# EasyEDA Pro project 第十届农装PCB工程.epro, board 作业板_2024_9
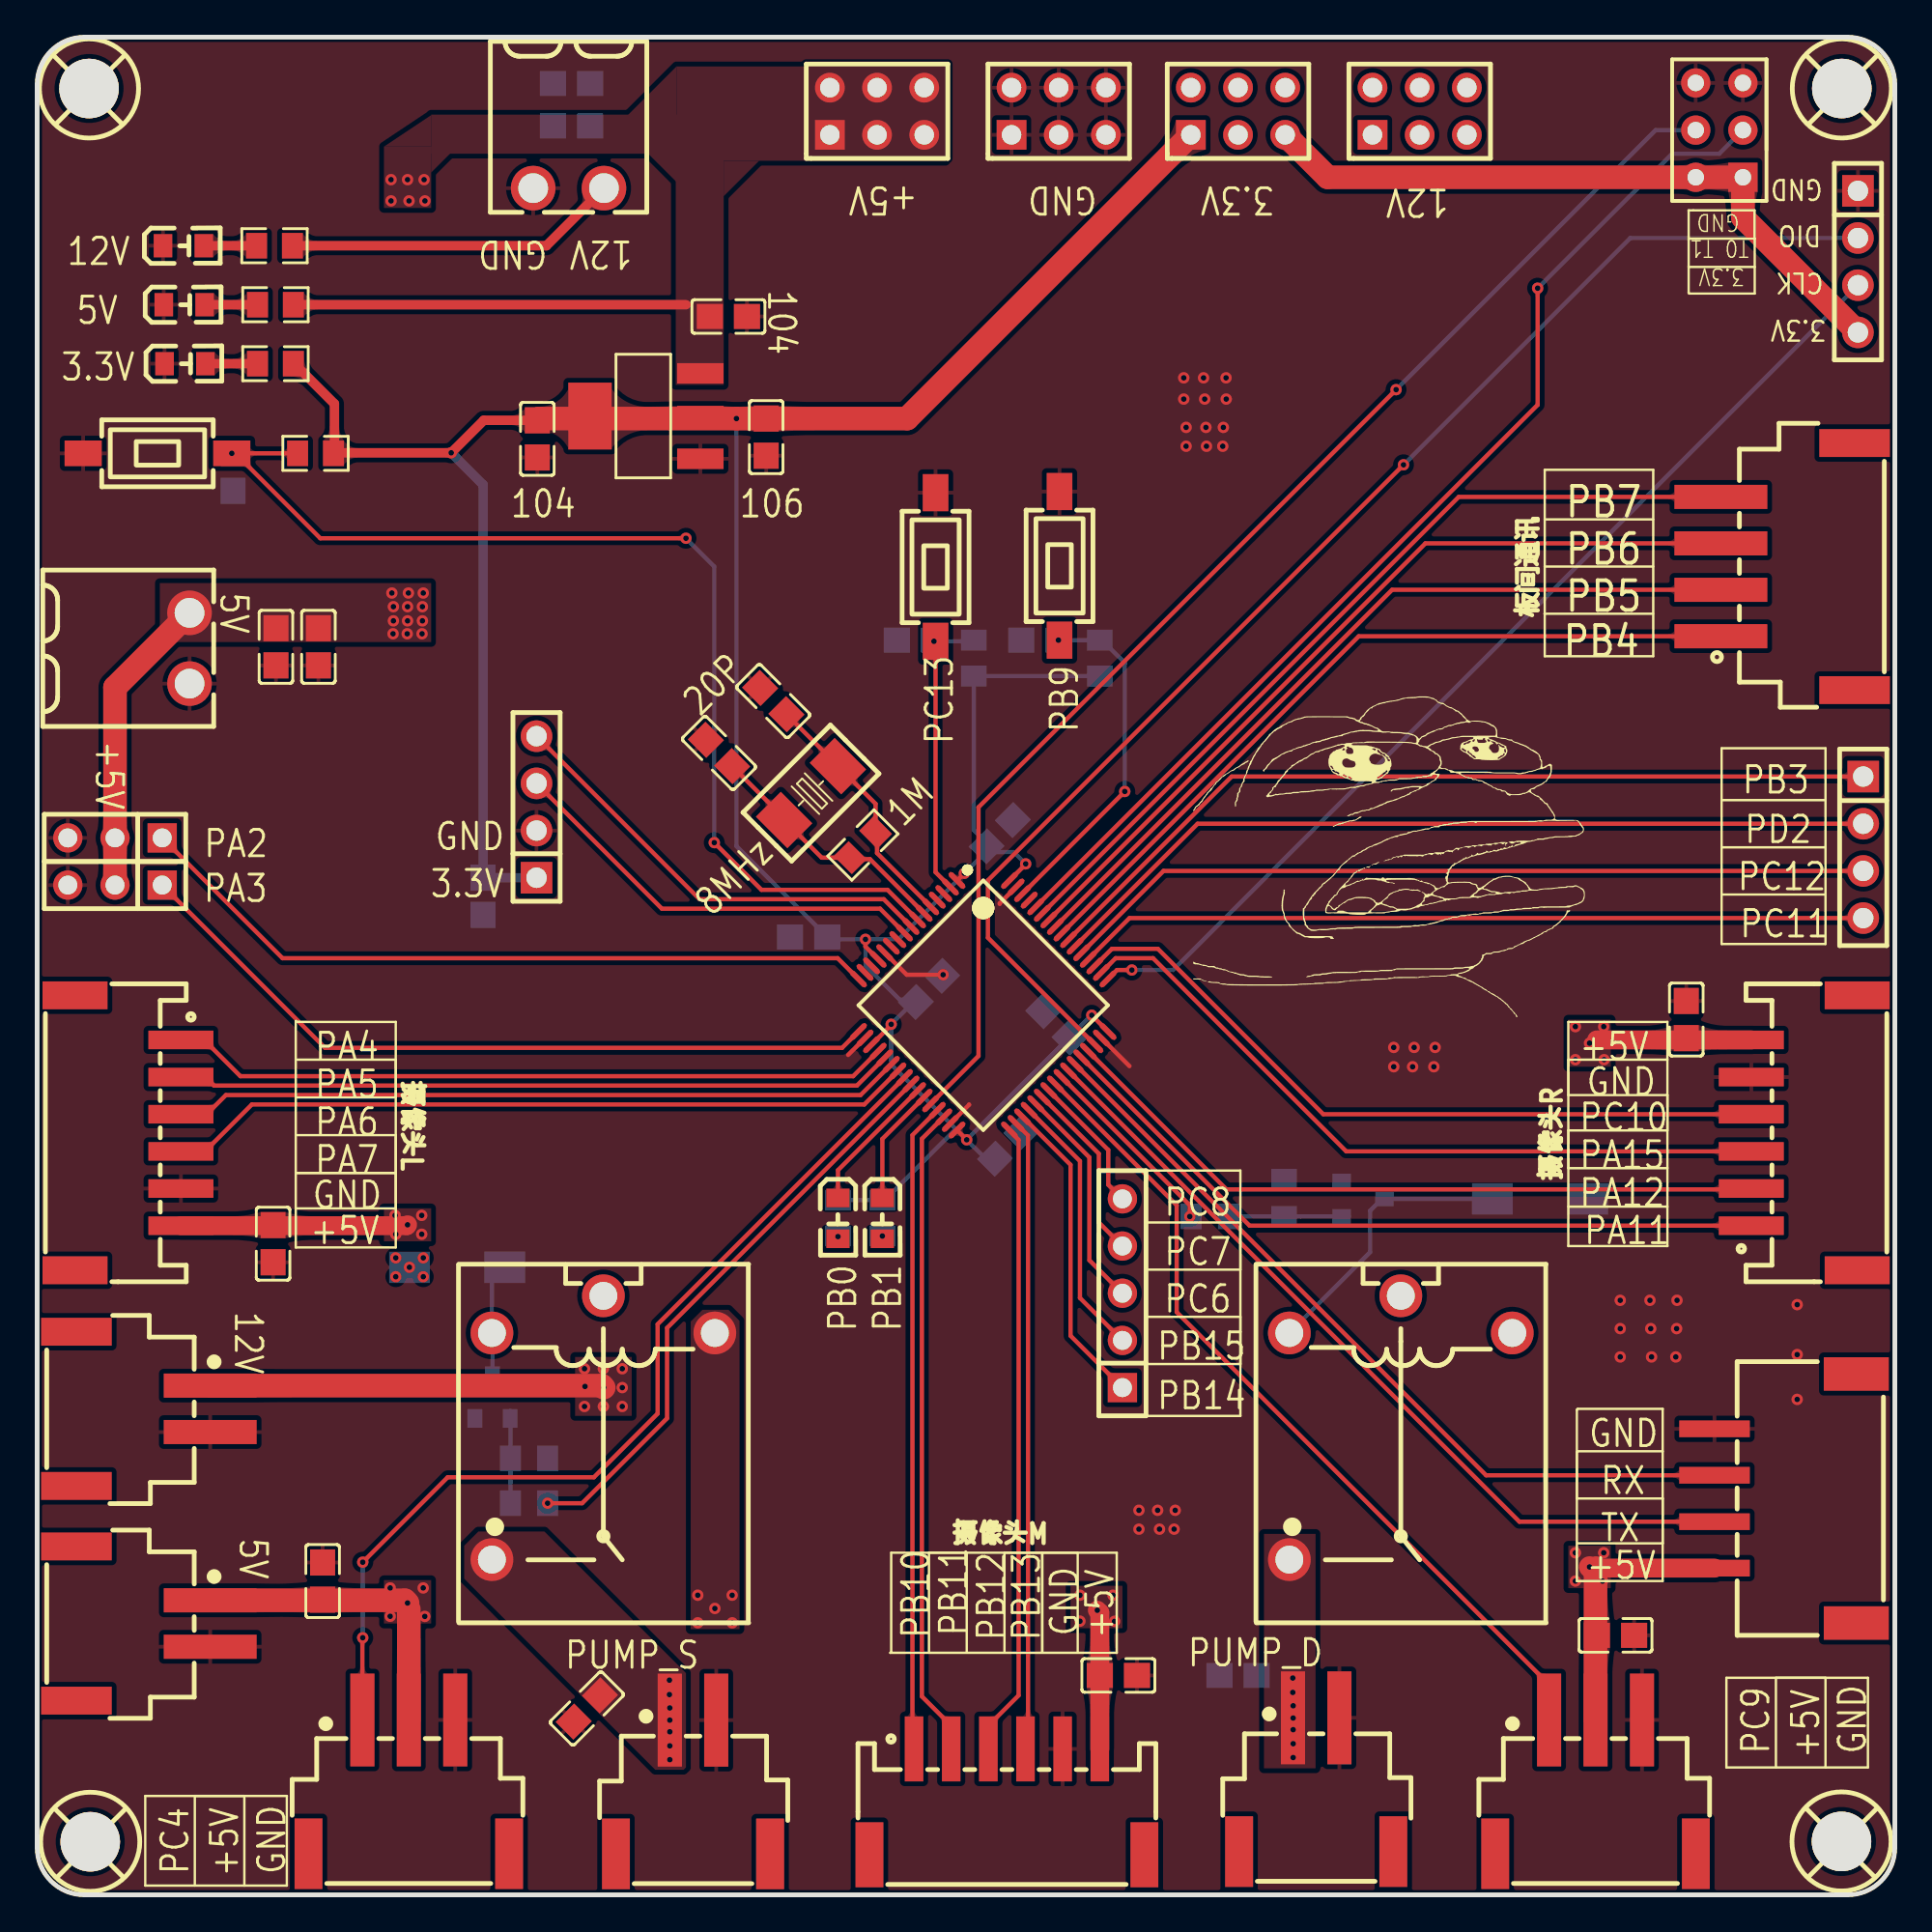
[diagram p5: board, top side]
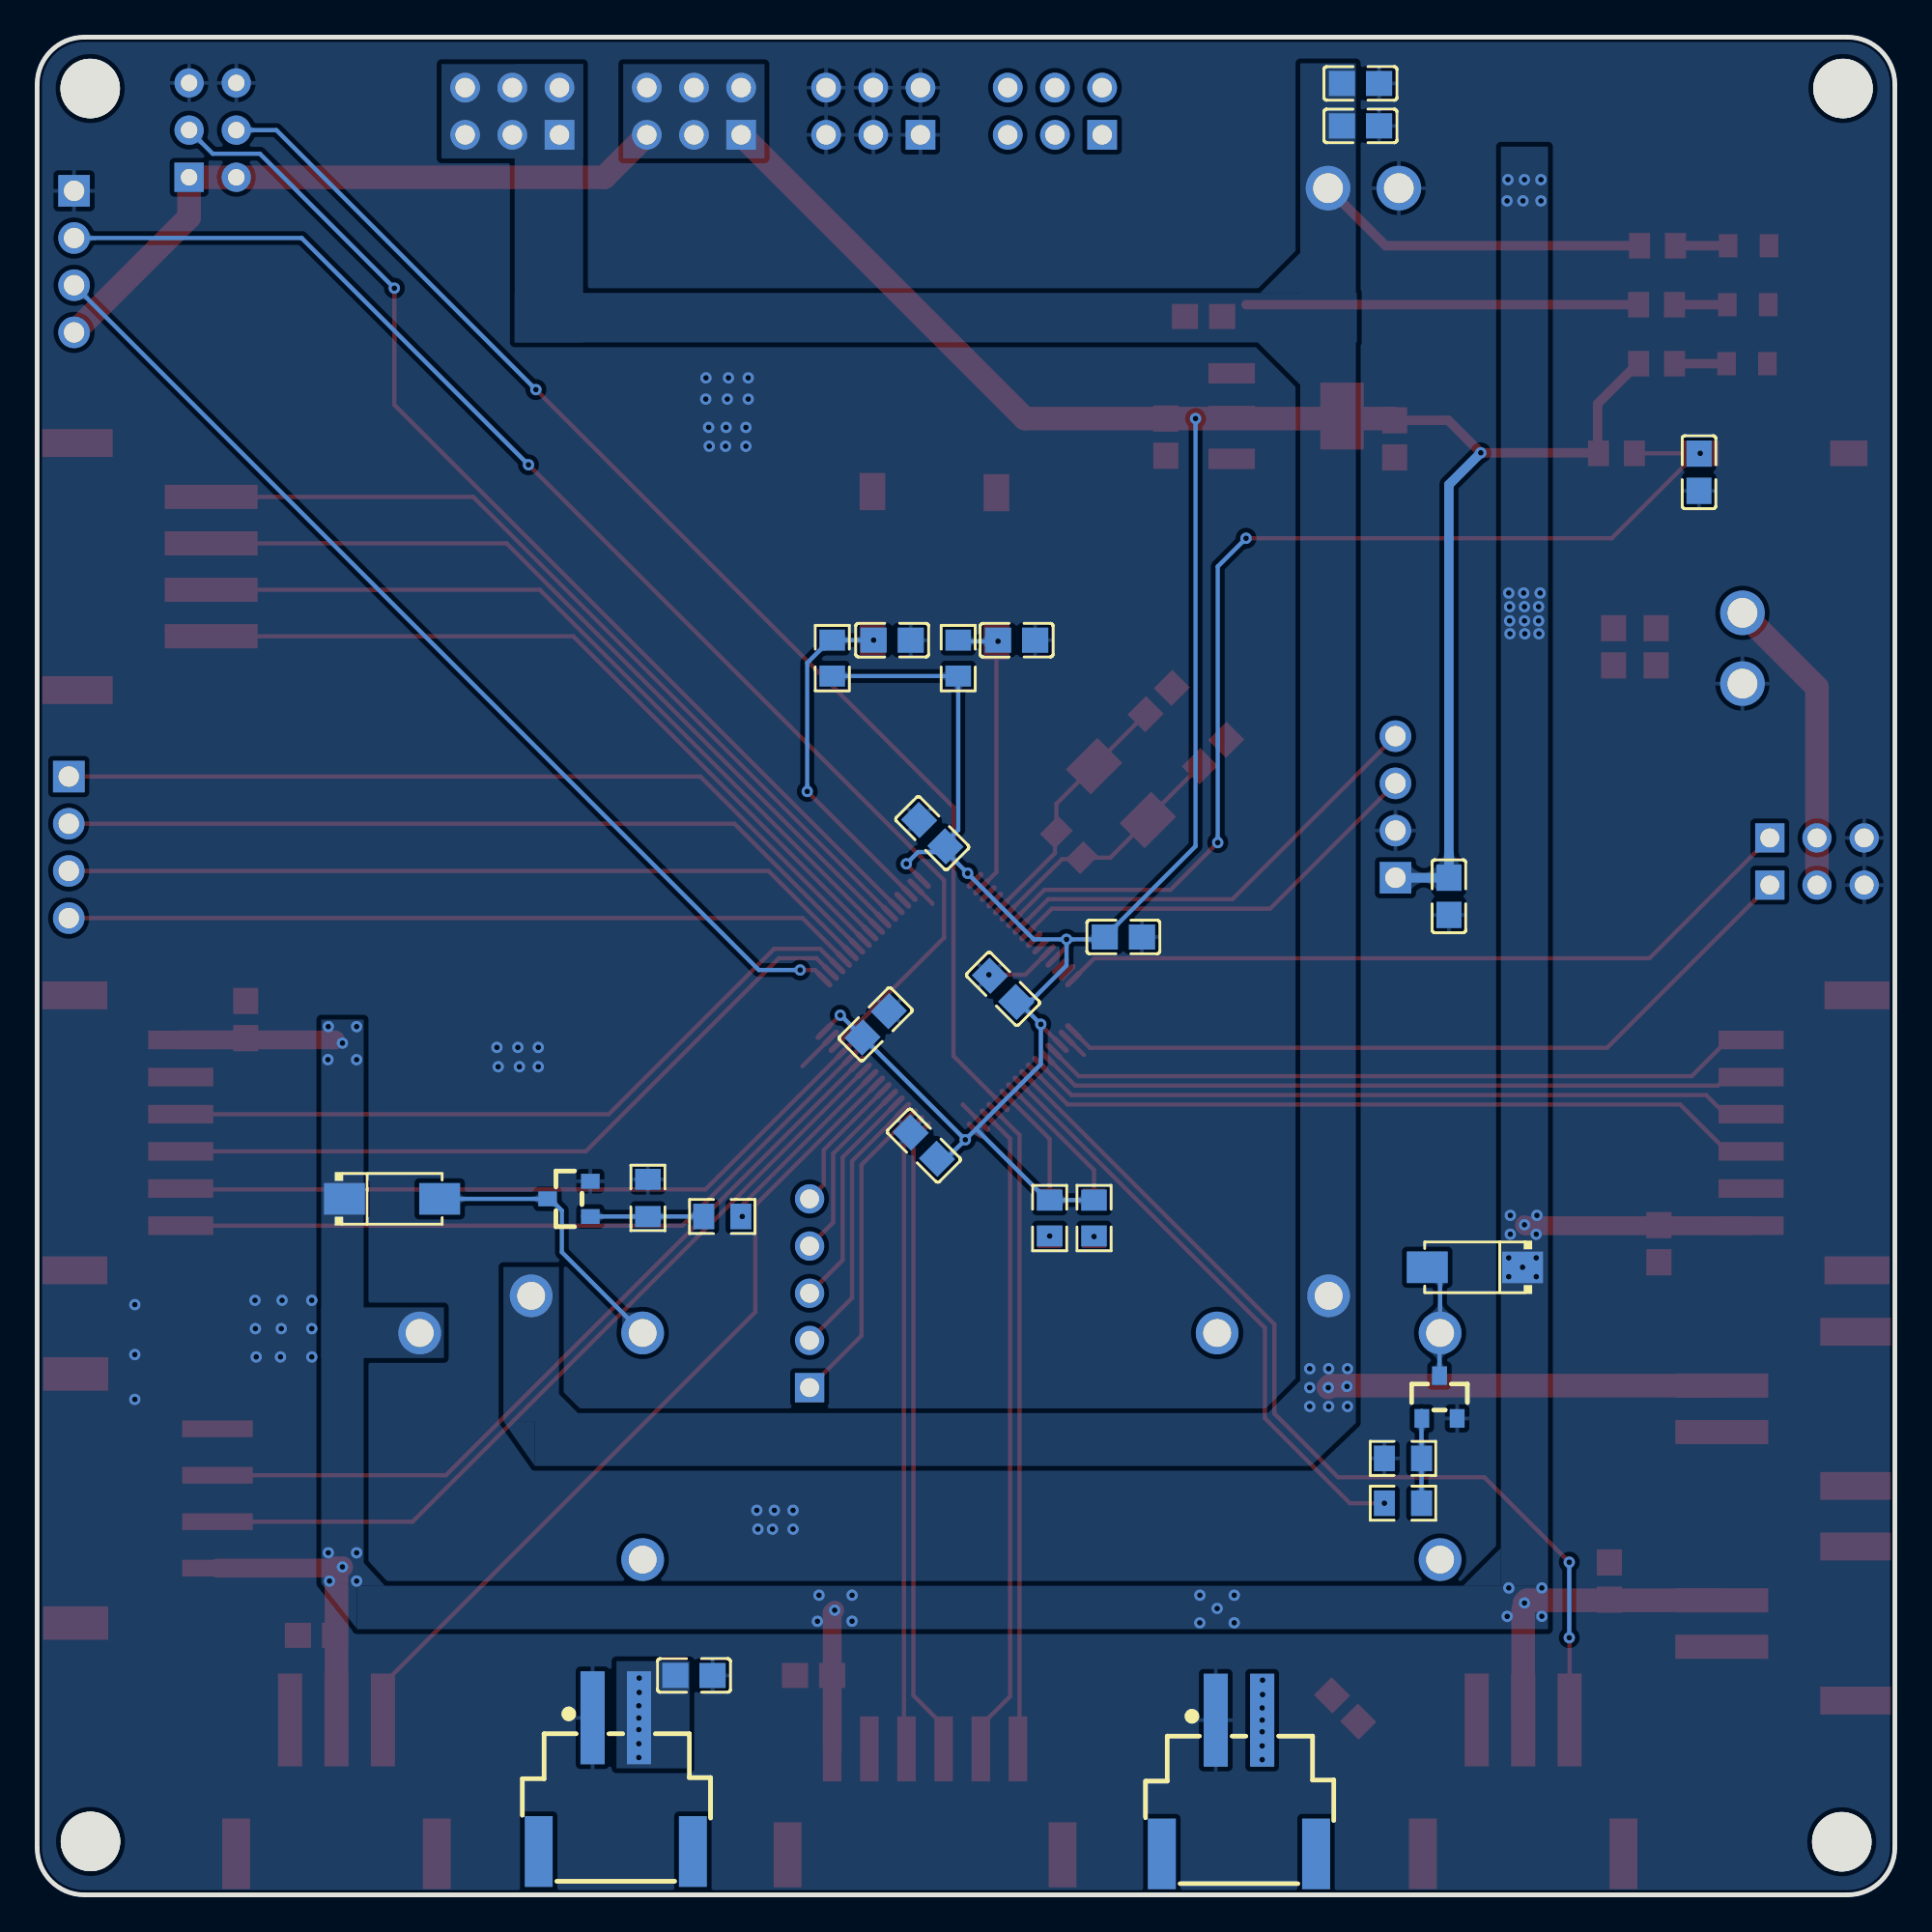
[diagram p6: board, bottom side, seen from below]

Outline 100 x 100 mm; copper layers: Top Layer, Bottom Layer. Coordinates in mm from the lower left corner of the outline.
Outline path: 0,97.46 0,2.54 arc(0.74,0.74) 2.54,0 97.46,0 arc(99.26,0.74) 100,2.54 100,97.46 arc(99.26,99.26) 97.46,100 2.54,100 arc(0.74,99.26) 0,97.46
Stack: Top Layer 0.035mm / Dielectric1 1.51mm FR4 er 4.5 / Bottom Layer 0.035mm

## Design rules (mm)
spacing safeClearance (default): track to track 0.152, other pairs 0 to 0.152
track width trackWidth (default): min 0.127, default 0.229, max 2.54
differential pair differentialPair (default): width min 0.127, default 0.254, max 2.54; gap min 0.152, default 0.152
via viaSize (default): diameter min 0.5, default 0.61, max 10; hole min 0.3, default 0.305, max 6

## Placement (name value [footprint] x y rotation side)
C1  0.1u  [C0805]  51.82 57.15 225 bottom
C2  0.1u  [C0805]  48.01 48.77 225 bottom
C3  0.1u  [C0805]  52.27 40.33 225 bottom
C4  0.1u  [C0805]  54.86 46.86 315 bottom
C6  0.1u  [C0805]  41.53 51.56 0 bottom
C9  20p  [C0805]  36.7 61.47 315 top
C10  20p  [C0805]  39.62 64.26 315 top
C11  0.1u  [C0805]  10.54 76.58 90 bottom
C14  104  [C0805]  37.21 84.96 180 top
C15  106  [C0805]  39.24 78.47 90 top
C16  104  [C0805]  26.92 78.38 90 top
C17  0.1u  [C0805]  47.28 67.54 0 bottom
C18  104  [C0805]  28.77 95.22 0 bottom
C19  104  [C0805]  12.85 67.18 90 top
C22  104  [C0805]  64.64 11.81 0 bottom
C24  104  [C0805]  12.7 35.05 270 top
C25  104  [C0805]  88.77 47.12 90 top
C26  106  [C0805]  28.77 97.51 0 bottom
C27  106  [C0805]  15.14 67.18 90 top
C28  104  [C0805]  15.37 16.89 270 top
C29  104  [C0805]  84.96 13.97 180 top
C30  104  [C0805]  24 53.75 90 bottom
C31  104  [C0805]  58.2 11.81 0 top
C32  104  [C0805]  29.59 10.03 45 top
C33  0.1u  [C0805]  53.97 67.54 0 bottom
CN1  -  [CONN-SMD_2.54-4P-WT-1]  94.11 21.34 90 top
CN2  KF2EDGR-3.81-2P  [CONN-TH_2P-P3.81_KF2EDGR-3.81-2P]  28.61 91.87 180 top
CN3  KF2EDGR-3.81-2P  [CONN-TH_2P-P3.81_KF2EDGR-3.81-2P]  8.2 67.11 270 top
D1  SS14  [SMA_L4.2-W2.6-LS5.3-RD]  22.61 33.78 0 bottom
D2  SS14  [SMA_L4.2-W2.6-LS5.3-RD]  80.9 37.47 180 bottom
FPC1  XH-4PWB  [CONN-SMD_4P-P2.50_DEALON_XH-4PWB]  94.23 71.5 90 top
FPC4  XH-3PWB  [CONN-SMD_3P-P2.50_DEALON_XH-3PWB]  83.89 5.81 0 top
FPC5  XH-3PWB  [CONN-SMD_3P-P2.50_DEALON_XH-3PWB]  20.01 5.81 0 top
FPC6  XH-2PWB  [CONN-SMD_2P-P2.50_DEALON_XH-2PWB_C2905024]  35.31 5.8 180 bottom
FPC7  XH-2PWB  [CONN-SMD_2P-P2.50_DEALON_XH-2PWB_C2905024]  35.31 5.8 0 top
FPC8  XH-2PWB  [CONN-SMD_2P-P2.50_DEALON_XH-2PWB_C2905024]  68.85 5.93 0 top
FPC9  XH-2PWB  [CONN-SMD_2P-P2.50_DEALON_XH-2PWB_C2905024]  68.85 5.93 180 bottom
FPC10  XH-2PWB  [CONN-SMD_2P-P2.50_DEALON_XH-2PWB_C2905024]  5.72 14.6 270 top
FPC11  XH-2PWB  [CONN-SMD_2P-P2.50_DEALON_XH-2PWB_C2905024]  5.72 26.16 270 top
H1  HDR-F-2.54_2x3  [HDR-F-2.54_2X3]  90.55 95 90 top
H2  2.54-1*4P母  [HDR-TH_4P-P2.54-V-F]  98.01 87.92 270 top
H7  -  [HDR-TH_6P-P2.54-V-R2-C3-S2.54_A2541WV-2X3P]  45.21 96.01 0 top
H8  -  [HDR-TH_6P-P2.54-V-R2-C3-S2.54_A2541WV-2X3P]  64.64 96.01 0 top
H9  -  [HDR-TH_6P-P2.54-V-R2-C3-S2.54_A2541WV-2X3P]  54.99 96.01 0 top
H10  -  [HDR-TH_4P-P2.54-V-M]  26.88 58.56 90 top
H11  -  [HDR-TH_6P-P2.54-V-R2-C3-S2.54_A2541WV-2X3P]  74.42 96.01 0 top
H12  -  [HDR-TH_3P-P2.54-V-F]  4.19 56.9 180 top
H13  -  [HDR-TH_3P-P2.54-V-F]  4.19 54.36 180 top
H14  -  [HDR-TH_4P-P2.54-V-F]  98.3 56.39 270 top
H15  -  [HDR-TH_5P-P2.54-V-F]  58.42 32.39 90 top
K1  SRD-5VDC-SL-A  [RELAY-TH_SRD-XXVDC-XX-A]  30.48 25.15 90 top
K2  SRD-5VDC-SL-A  [RELAY-TH_SRD-XXVDC-XX-A]  73.41 25.15 90 top
Q1  -  [S8050_SOT-23]  24.64 26.8 270 bottom
Q2  -  [S8050_SOT-23]  71.37 37.34 180 bottom
R1  1M  [R0805_NEW]  44.45 56.52 45 top
R2  10k  [R0805_NEW]  14.99 77.6 0 top
R3  1k  [R0805_NEW]  12.78 88.77 180 top
R4  10k  [R0805_NEW]  50.42 66.58 270 bottom
R7  1k  [R0805_NEW]  45.5 36.43 270 bottom
R8  1k  [R0805_NEW]  12.83 85.6 180 top
R9  1k  [R0805_NEW]  12.83 82.42 180 top
R17  10K  [R0805]  26.48 23.5 180 bottom
R18  1K  [R0805]  26.48 21.08 180 bottom
R19  10K  [R0805]  67.12 37.52 270 bottom
R20  1K  [R0805]  63.12 36.52 0 bottom
R21  10k  [R0805_NEW]  57.2 66.58 270 bottom
R22  1k  [R0805_NEW]  43.11 36.43 270 bottom
SCREW1  -  [M3螺丝]  2.86 97.17 0 top
SCREW2  -  [M3螺丝]  97.21 97.17 0 top
SCREW3  -  [M3螺丝]  2.92 2.79 0 top
SCREW4  -  [M3螺丝]  97.19 2.81 0 top
SW1  -  [SW-SMD_L6.1-W3.6-LS8.0]  6.48 77.6 0 top
SW2  -  [SW-SMD_L6.1-W3.6-LS8.0]  48.36 71.48 270 top
SW3  -  [SW-SMD_L6.1-W3.6-LS8.0]  55.03 71.54 270 top
U1  -  [STM32F103RCT6]  50.93 54.74 315 top
U3  AMS1117-3.3  [AMS1117]  32.73 79.6 0 top
U8  -  [LED0805-RD_PURPLE]  45.5 36.42 270 top
U9  -  [LED0805-RD_PURPLE]  7.96 82.42 0 top
U10  -  [LED0805-RD_PURPLE]  7.87 88.77 0 top
U11  -  [LED0805-RD_PURPLE]  7.92 85.6 0 top
U24  ZX-PH2.0-WT6P  [CONN-SMD_6P-P2.00_ZX-PH2.0-WT6P]  4.89 41.02 270 top
U25  ZX-PH2.0-WT6P  [CONN-SMD_6P-P2.00_ZX-PH2.0-WT6P]  95.12 41.02 90 top
U26  ZX-PH2.0-WT6P  [CONN-SMD_6P-P2.00_ZX-PH2.0-WT6P]  52.2 5.01 0 top
U27  -  [LED0805-RD_PURPLE]  43.11 36.42 270 top
X3  8MHz  [OSC-SMD_L5.0-W3.2]  41.66 59.31 45 top

## Footprints (pads in the part's own frame, mm; a bottom-side part is the same pattern mirrored in y, then rotated)
AMS1117
  rect 2.5x1.1 smd: 1(2.97,-2.3) 2(2.97,0) 3(2.97,2.3)
  rect 2.34x3.6 smd: 4(-2.97,0)
C0805
  rect 1.41x1.35 smd: 1(-1,0) 2(1,0)
CONN-SMD_2.54-4P-WT-1
  rect 0.899x3.8 smd: 1(-3.749,3.815) 2(-1.25,3.815) 3(1.25,3.815) 4(3.749,3.815)
  rect 1.801x3.5 smd: 5(-6.703,-3.817) 6(6.703,-3.817)
CONN-SMD_2P-P2.50_DEALON_XH-2PWB_C2905024
  rect 1.3x5 smd: 1(-1.25,3.6) 2(1.25,3.6)
  rect 1.5x3.8 smd: 3(-4.15,-3.6) 4(4.15,-3.6)
CONN-SMD_3P-P2.50_DEALON_XH-3PWB
  rect 1.3x5 smd: 1(-2.5,3.6) 2(0,3.6) 3(2.5,3.6)
  rect 1.5x3.8 smd: 4(-5.4,-3.6) 5(5.4,-3.6)
CONN-SMD_4P-P2.50_DEALON_XH-4PWB
  rect 1.3x5 smd: 1(-3.75,3.6) 2(-1.25,3.6) 3(1.25,3.6) 4(3.75,3.6)
  rect 1.5x3.8 smd: 5(-6.65,-3.6) 6(6.65,-3.6)
CONN-SMD_6P-P2.00_ZX-PH2.0-WT6P
  rect 1x3.5 smd: 1(-5,2.85) 2(-3,2.85) 3(-1,2.85) 4(1,2.85) 5(3,2.85) 6(5,2.85)
  rect 1.5x3.5 smd: 7(7.4,-2.85) 8(-7.4,-2.85)
CONN-TH_2P-P3.81_KF2EDGR-3.81-2P
  round 2.4 hole 1.6: 1(-1.905,0) 2(1.905,0)
HDR-F-2.54_2X3
  rect 1.575x1.575 hole 0.889: 1(-2.54,-1.27)
  round 1.575 hole 0.889: 2(-2.54,1.27) 3(0,-1.27) 4(0,1.27) 5(2.54,-1.27) 6(2.54,1.27)
HDR-TH_3P-P2.54-V-F
  rect 1.575x1.575 hole 1.02: 1(-2.54,0)
  round 1.575 hole 1.02: 2(0,0) 3(2.54,0)
HDR-TH_4P-P2.54-V-F
  rect 1.7x1.7 hole 1.1: 1(-3.81,0)
  round 1.7 hole 1.1: 2(-1.27,0) 3(1.27,0) 4(3.81,0)
HDR-TH_4P-P2.54-V-M
  rect 1.7x1.7 hole 1.1: 1(-3.81,0)
  round 1.7 hole 1.1: 2(-1.27,0) 3(1.27,0) 4(3.81,0)
HDR-TH_5P-P2.54-V-F
  rect 1.575x1.575 hole 1.02: 1(-5.08,0)
  round 1.575 hole 1.02: 2(-2.54,0) 3(0,0) 4(2.54,0) 5(5.08,0)
HDR-TH_6P-P2.54-V-R2-C3-S2.54_A2541WV-2X3P
  rect 1.6x1.6 hole 1.05: 1(-2.54,-1.27)
  round 1.6 hole 1.05: 2(-2.54,1.27) 3(0,-1.27) 4(0,1.27) 5(2.54,-1.27) 6(2.54,1.27)
LED0805-RD_PURPLE
  rect 1.001x1.25 smd: 1(-1.1,0) 2(1.1,0)
M3螺丝
  round 3.2 hole 3.2: 1(-0.064,0.064)
OSC-SMD_L5.0-W3.2
  rect 1.9x2.4 smd: 1(-2.05,0) 2(2.05,0)
R0805
  rect 1.133x1.377 smd: 1(-1,0) 2(1,0)
R0805_NEW
  rect 1.133x1.377 smd: 1(-0.966,0) 2(0.966,0)
RELAY-TH_SRD-XXVDC-XX-A
  round 2.3 hole 1.5: 1(-7.1,6) 2(5.099,-6) 3(7.1,0) 4(5.099,6)
S8050_SOT-23
  rect 1x0.8 smd: 1(1.15,-0.823) 2(1.15,1.077) 3(-1.15,0.127)
SMA_L4.2-W2.6-LS5.3-RD
  rect 2.2x1.7 smd: 1(-2.566,0) 2(2.566,0)
STM32F103RCT6
  custom 1.159x0.3 smd: 1(-0.907,-1.093) 48(10.593,-1.093)
  custom 1.16x0.3 smd: 2(-0.907,-1.593) 3(-0.907,-2.093) 4(-0.907,-2.593) 5(-0.907,-3.093) 6(-0.907,-3.593) 7(-0.907,-4.093) 8(-0.907,-4.593) 9(-0.907,-5.093) 10(-0.907,-5.593) 11(-0.907,-6.093) 12(-0.907,-6.593) 13(-0.907,-7.093) 14(-0.907,-7.593) 15(-0.907,-8.093) 16(-0.907,-8.593) 33(10.593,-8.593) 34(10.593,-8.093) 35(10.593,-7.593) 36(10.593,-7.093) 37(10.593,-6.593) 38(10.593,-6.093) 39(10.593,-5.593) 40(10.593,-5.093) 41(10.593,-4.593) 42(10.593,-4.093) 43(10.593,-3.593) 44(10.593,-3.093) 45(10.593,-2.593) 46(10.593,-2.093) 47(10.593,-1.593)
  custom 0.3x1.159 smd: 17(1.093,-10.593) 28(6.593,-10.593) 30(7.593,-10.593) 51(7.593,0.907) 53(6.593,0.907) 56(5.093,0.907) 58(4.093,0.907) 60(3.093,0.907)
  custom 0.3x1.16 smd: 18(1.593,-10.593) 19(2.093,-10.593) 20(2.593,-10.593) 21(3.093,-10.593) 22(3.593,-10.593) 23(4.093,-10.593) 24(4.593,-10.593) 25(5.093,-10.593) 26(5.593,-10.593) 27(6.093,-10.593) 29(7.093,-10.593) 31(8.093,-10.593) 32(8.593,-10.593) 49(8.593,0.907) 50(8.093,0.907) 52(7.093,0.907) 54(6.093,0.907) 55(5.593,0.907) 57(4.593,0.907) 59(3.593,0.907) 61(2.593,0.907) 62(2.093,0.907) 63(1.593,0.907) 64(1.093,0.907)
SW-SMD_L6.1-W3.6-LS8.0
  rect 2x1.38 smd: 1(-4,0) 2(4,0)

## Nets
As in the schematic.

Pads without a net: CN1 5 6; FPC1 5 6; FPC4 4 5; FPC5 4 5; FPC6 3 4; FPC7 3 4; FPC8 3 4; FPC9 3 4; FPC10 3 4; FPC11 3 4; SCREW1 1; SCREW2 1; SCREW3 1; SCREW4 1; U24 7 8; U25 7 8; U26 7 8

## Via types
v1: diameter 0.61, hole 0.305, Top Layer to Bottom Layer, 137 vias

## Routing (per net, layer and track width the routed paths; a pad name or vN(x,y) marks a point on that pad's centre or on a via; arc(x,y) is an arc through that point)
3.3V: length 221.7
  Top Layer w0.229: U1.1 49.53,54.61 v1(49.91,54.99) ; v1(44.59,51.44) 44.59,51.04 45.27,50.36 ; v1(45.97,46.86) 45.97,46.82 U1.19 ; v1(56.77,47.35) U1.48 ; v1(53.21,55.5) 53.21,55.48 52.34,54.61 ; U1.32 v1(50.04,40.64)
  Top Layer w0.508: C16.2 24.04,79.38 v1(22.29,77.62) 16.26,77.62 ; 13.79,82.47 16,80.26 16,77.5 15.88,77.37
  Top Layer w1.27: H2.4 91.82,90.3 H1.1 H1.2 69.47,92.46 H8.5 ; H8.1 46.83,79.47 C15.2 v1(37.64,79.47) 27.02,79.47 C16.2
  Bottom Layer w0.229: v1(44.59,51.44) 44.59,50.03 46.43,48.19 47.3,48.19 ; v1(44.59,51.44) 46.35,51.44 v1(49.91,54.99) 50.93,56.01 50.93,56.13 52.58,56.13 v1(53.21,55.5) ; v1(44.59,51.44) 43.18,51.44 43.05,51.56 ; 51.56,56.15 51.56,56.18 50.42,57.32 50.42,65.61 57.2,65.61 ; 47.3,48.19 v1(45.97,46.86) 45.97,44.71 47.38,43.3 ; 47.3,48.19 47.37,48.26 47.5,48.26 ; 47.3,48.19 47.3,48.06 ; 49.45,41.24 49.45,41.23 45.62,37.4 R7.1 ; 49.45,41.24 v1(50.04,40.64) ; 49.45,41.24 47.38,43.3 ; 47.38,43.3 47.37,43.3 ; v1(50.04,40.64) 51.06,39.62 ; v1(50.04,40.64) 56.76,47.37 ; 43.11,37.4 45.5,37.4 ; C6.2 37.64,56.45 v1(37.64,79.47)
  Bottom Layer w0.508: H10.1 C30.2 24,75.91 v1(22.29,77.62)
12V: length 39.3
  Top Layer w0.508: R3.1 27.41,88.77 CN2.1
  Top Layer w1.27: v1(30.5,27.31) 30.39,27.41 FPC11.1
  vias: v1(29.46,28.32) v1(29.49,27.37) v1(29.46,26.29) v1(30.48,28.32) v1(30.48,26.29) v1(31.5,28.32) v1(31.5,27.31) v1(31.5,26.29)
+5V: length 97.1
  Top Layer w0.508: R8.1 34.93,85.6
  Top Layer w1.016: CN1.1 83.63,17.59 ; v1(19.94,36.07) 19.89,36.02 U24.6 ; U25.6 83.95,46.02 ; v1(57.07,15.32) 57.2,15.19 U26.6
  Top Layer w1.143: 83.63,17.59 v1(83.57,17.65)
  Top Layer w1.27: v1(19.94,15.71) 19.79,15.85 FPC10.1 ; 83.92,17.59 83.89,17.56 FPC4.2 ; FPC5.2 20.01,15.37 ; H13.2 H12.2 4.19,65 CN3.1
  vias: v1(19.05,92.33) v1(19.05,91.19) v1(19,16.52) v1(19,15) v1(19.09,70.08) v1(19.18,69.34) v1(19.18,68.58) v1(19.16,67.88) v1(19.27,36.58) v1(19.3,35.56) v1(19.3,34.29) v1(19.3,33.27) v1(19.94,92.33) v1(19.94,69.34) v1(19.94,68.58) v1(19.92,67.88) v1(20.02,91.19) v1(19.98,70.08) v1(20.04,33.78) v1(20.74,69.34) v1(20.74,68.58) v1(20.72,67.88) v1(20.7,36.58) v1(20.7,35.56) v1(20.83,92.33) v1(20.78,70.08) v1(20.78,34.29) v1(20.78,33.27) v1(20.78,16.52) v1(20.88,91.19) v1(20.87,14.99) v1(35.56,16.13) v1(35.56,14.64) v1(36.48,15.42) v1(37.41,16.13) v1(37.42,14.64) v1(56.13,16.13) v1(56.13,14.73) v1(57.91,16.13) v1(58,14.72) v1(82.8,46.74) v1(82.8,44.96) v1(82.8,18.41) v1(82.8,16.89) v1(83.57,45.85) v1(84.33,46.74) v1(84.35,44.96) v1(84.33,18.41) v1(84.26,16.89)
GND: length 9.8
  Top Layer w0.229: U1.18 43.66,45.21 ; U1.12 46.81,49.53 v1(48.77,49.53) ; 50.16,42.55 50.16,42.53 U1.31 ; 57.29,46.12 58.8,44.61 ; 52.69,54.25 51.82,53.37 51.82,53.34
  vias: v1(59.31,20.7) v1(59.31,19.69) v1(60.31,20.7) v1(60.42,19.69) v1(61.2,19.69) v1(61.26,20.7) v1(61.72,81.66) v1(61.72,80.52) v1(61.85,78.99) v1(61.85,77.98) v1(62.79,81.66) v1(62.85,80.52) v1(62.91,78.99) v1(62.94,77.98) v1(63.82,77.98) v1(63.85,78.99) v1(64,81.66) v1(64.01,80.52) v1(73.03,45.62) v1(73.03,44.58) v1(74.04,44.58) v1(74.12,45.62) v1(75.18,44.58) v1(75.25,45.62) v1(85.22,32) v1(85.22,30.48) v1(85.22,28.96) v1(86.82,32) v1(86.86,30.48) v1(86.9,28.96) v1(88.21,28.96) v1(88.27,32) v1(88.25,30.48) v1(94.74,31.77) v1(94.74,29.08) v1(94.74,26.67)
BOOT0: length 59.5
  Top Layer w0.229: U1.60 80.77,80.21 v1(80.77,86.49)
  Bottom Layer w0.229: 92.33,95 92.2,94.87 91.95,94.87 ; v1(80.77,86.49) 88.01,93.73 90.55,93.73 H1.3
BOOT1: length 70.7
  Top Layer w0.229: U1.28 50.67,45.16 50.67,58.55 v1(73.15,81.03)
  Bottom Layer w0.229: v1(73.15,81.03) 87.12,95 H1.4
MCU_RXD: length 43.6
  Top Layer w0.229: CN1.3 78,22.59 U1.43
MCU_TXD: length 44.8
  Top Layer w0.229: U1.42 79.79,20.09 CN1.2
NRST: length 59.5
  Top Layer w0.229: v1(36.45,56.64) 38.99,54.1 45.77,54.1 U1.7 ; R2.1 v1(10.48,77.6) ; 10.48,77.47 10.8,77.47 15.24,73.03 v1(34.93,73.03)
  Bottom Layer w0.229: v1(36.45,56.64) 36.45,71.5 v1(34.93,73.03)
OSC_IN: length 13.7
  Top Layer w0.229: 40.26,63.63 43.11,60.78 X3.2 45.13,58.73 45.13,57.2 45.21,57.12 45.21,56.08 U1.5
OSC_OUT: length 14.3
  Top Layer w0.229: 37.08,61.09 40.31,57.86 X3.1 42.23,55.83 43.77,55.83 43.85,55.75 44.83,55.75 47.75,52.84
PA2: length 40.6
  Top Layer w0.229: H12.1 13.21,50.42 43.09,50.42 U1.16
PA3: length 41.5
  Top Layer w0.229: U1.17 43.33,45.59 15.49,45.59 H13.1
PA4: length 38.9
  Top Layer w0.229: 45.27,45.41 43.93,44.07 10.94,44.07 8.99,46.02 U24.1
PA5: length 38.7
  Top Layer w0.229: U1.21 44.12,43.56 9.53,43.56 9.06,44.02 U24.2
PA6: length 39.4
  Top Layer w0.229: U1.22 44.32,43.05 10.16,43.05 9.13,42.02 U24.3
PA7: length 40.4
  Top Layer w0.229: U1.23 44.52,42.55 11.56,42.55 9.03,40.02 U24.4
PA8: length 10.3
  Top Layer w0.229: 55.17,44 62.05,37.12 v1(62.05,36.52)
PA11: length 39.8
  Top Layer w0.229: U25.1 65.27,36.02 U1.44
PA12: length 38.8
  Top Layer w0.229: U25.2 92.22,37.97 64.02,37.97 56.58,45.41
PA15: length 39.6
  Top Layer w0.229: U25.3 70.47,40.02 60.07,50.42 58.05,50.42 57.29,49.66
PB0: length 7.6
  Top Layer w0.229: U27.1 43.11,39.01 U1.26
PB1: length 6.4
  Top Layer w0.229: U8.1 45.5,40.69 47.75,42.94
PB3: length 46.4
  Top Layer w0.229: H14.1 64.3,60.2 U1.55
PB4: length 42.1
  Top Layer w0.229: 55.17,51.78 71.14,67.75 FPC1.1
PB5: length 43.3
  Top Layer w0.229: FPC1.2 72.94,70.25 U1.57
PB6: length 44.6
  Top Layer w0.229: FPC1.3 74.73,72.75 U1.58
PB7: length 45.8
  Top Layer w0.229: U1.59 76.52,75.25 FPC1.4
PB9: length 18.8
  Top Layer w0.229: U1.62 v1(58.55,59.4)
  Bottom Layer w0.229: v1(54.97,67.54) R21.1 57.32,67.54 58.55,66.31 v1(58.55,59.4)
PB10: length 35
  Top Layer w0.229: U26.1 47.12,7.94 47.12,40.9 U1.29
PB11: length 35.2
  Top Layer w0.229: U1.30 47.62,40.7 47.62,10.68 49.2,9.11 U26.2
PB12: length 34.2
  Top Layer w0.229: U26.3 51.2,9.11 52.83,10.74 52.83,40.64 52.34,41.13 52.34,41.17
PB13: length 34
  Top Layer w0.229: U26.4 53.34,7.99 53.34,40.88 52.69,41.52
PB14: length 16.8
  Top Layer w0.229: U1.35 55.63,39.3 55.63,30.1 H15.1
PB15: length 14.5
  Top Layer w0.229: H15.2 56.13,32.13 56.13,39.5 U1.36
PC0: length 24.4
  Top Layer w0.229: H10.4 35.66,53.59 45.57,53.59 U1.8
PC1: length 23.1
  Top Layer w0.229: 46.68,51.78 45.38,53.09 33.63,53.09 H10.3
PC4: length 51.3
  Top Layer w0.229: FPC5.1 17.51,13.82 v1(17.53,13.84) ; v1(17.53,17.91) 22.1,22.48 29.97,22.48 33.4,25.91 33.4,30.72 46.68,44
  Bottom Layer w0.229: v1(17.53,17.91) v1(17.53,13.84)
PC5: length 31.8
  Top Layer w0.229: v1(27.48,21.08) 29.34,21.08 33.91,25.65 33.91,30.52 U1.25
PC6: length 12.1
  Top Layer w0.229: U1.37 56.64,39.7 56.64,34.16 H15.3
PC7: length 9.8
  Top Layer w0.229: U1.38 57.15,39.9 57.15,36.19 58.42,34.92
PC8: length 7.5
  Top Layer w0.229: H15.5 57.66,38.23 57.66,40.1 U1.39
PC9: length 45.2
  Top Layer w0.229: U1.40 61.34,37.12 61.34,31.37 81.39,11.32 FPC4.1
PC10: length 39.4
  Top Layer w0.229: U1.51 57.85,50.93 60.32,50.93 69.23,42.02 U25.4
PC11: length 42.6
  Top Layer w0.229: H14.4 58.8,52.58 56.58,50.36
PC12: length 43.9
  Top Layer w0.229: H14.3 60.63,55.12 U1.53
PC13: length 16
  Top Layer w0.229: SW2.2 48.36,55.05 U1.2
  Bottom Layer w0.229: v1(48.28,67.48) 50.76,67.48
PD2: length 45.2
  Top Layer w0.229: H14.2 62.46,57.66 U1.54
SWCLK: length 55.8
  Top Layer w0.229: U1.49 58.13,49.78 v1(58.93,49.78)
  Bottom Layer w0.229: H2.3 61.15,49.78 v1(58.93,49.78)
SWDIO: length 72.4
  Top Layer w0.229: U1.46 51.18,51.52 51.18,54.61 v1(73.55,76.98)
  Bottom Layer w0.229: v1(73.55,76.98) 85.76,89.19 H2.2
V_PUMP_D:
  vias: v1(67.59,11.67) v1(67.59,10.9) v1(67.61,10.18) v1(67.61,9.52) v1(67.61,8.89) v1(67.61,8.14) v1(67.61,7.39)
V_PUMP_S:
  vias: v1(34.04,11.56) v1(34.04,10.78) v1(34.06,10.06) v1(34.06,9.4) v1(34.06,8.78) v1(34.06,8.02) v1(34.06,7.28)
$1N23071:
  vias: v1(45.5,35.46)
$1N23222: length 2.8
  Top Layer w0.508: R9.2 U9.2
$1N23931: length 2.8
  Top Layer w0.508: U10.2 R3.2
$1N24046: length 2.8
  Top Layer w0.508: U11.2 R8.2
$1N38531: length 5
  Bottom Layer w0.229: R18.2 R17.2 25.48,26.06
$1N38532: length 6.1
  Bottom Layer w0.229: D1.2 24.48,33.09 K1.4 24.51,30.21 Q1.3
$1N38756: length 6.5
  Bottom Layer w0.229: R20.2 68.01,36.52 ; 70.6,36.52 68.04,36.52
$1N38760: length 15.2
  Bottom Layer w0.229: D2.2 72.39,37.47 71.75,36.83 71.75,34.59 K2.4
$1N48101:
  vias: v1(43.11,35.44)

## Copper pours and planes (outline as drawn; the poured copper is in the pictures)
3.3V on Bottom Layer: 60.84,98.55 68.45,98.55 68.45,93.47 60.84,93.47
5V on Top Layer: 41.4,98.55 49.02,98.55 49.02,93.47 41.4,93.47
12V on Top Layer: 28.96,28.96 32,28.96 32,25.78 28.96,25.78
12V on Bottom Layer: 29.01,25.4 31.44,25.4 31.44,23.09 29.01,23.09
12V on Bottom Layer: 71.91,33.8 74.9,33.8 74.9,25.5 71.91,25.5
12V on Bottom Layer: 70.61,98.55 74.29,98.55 74.29,83.57 70.61,83.57
12V on Bottom Layer: 32,83.69 34.42,83.69 34.42,81.28 32,81.28
12V on Bottom Layer: 28.96,86.23 74.29,86.23 74.29,83.57 28.96,83.57
12V on Bottom Layer: 32,88.39 34.16,88.39 34.16,86.23 32,86.23
12V on Bottom Layer: 31.44,25.93 73.21,25.93 73.21,23.09 31.44,23.09
12V on Bottom Layer: 70.36,27.43 72.39,27.43 72.39,25.4 70.36,25.4
12V on Bottom Layer: 31.75,27.94 33.78,27.94 33.78,25.91 31.75,25.91
12V on Bottom Layer: 73.21,25.5 74.9,25.5 74.9,23.09 73.21,23.09
12V on Bottom Layer: 70.61,98.55 78.23,98.55 78.23,93.47 70.61,93.47
12V on Bottom Layer: 29.01,98.59 32,98.59 32,25.4 29.01,25.4
+5V on Top Layer: 31.75,98.42 34.42,98.42 34.42,95.75 31.75,95.75
+5V on Top Layer: 34.38,94.16 36.96,94.16 36.96,81.28 34.38,81.28
+5V on Top Layer: 21.21,95.83 35,95.83 35,93.73 21.21,93.73
+5V on Top Layer: 82.42,18.8 84.71,18.8 84.71,16.51 82.42,16.51
+5V on Top Layer: 35.18,31.5 37.81,31.5 37.81,14.3 35.18,14.3
+5V on Top Layer: 41.4,98.55 49.02,98.55 49.02,93.47 41.4,93.47
+5V on Top Layer: 18.67,95.8 21.21,95.8 21.21,94.11 18.67,94.11
+5V on Top Layer: 18.67,94.11 21.21,94.11 21.21,90.81 18.67,90.81
+5V on Top Layer: 55.63,16.64 58.42,16.64 58.42,14.35 55.63,14.35
+5V on Top Layer: 82.42,47.12 84.71,47.12 84.71,44.58 82.42,44.58
+5V on Top Layer: 32.51,94.11 34.42,94.11 34.42,92.2 32.51,92.2
+5V on Top Layer: 34.42,98.42 48.9,98.42 48.9,93.34 34.42,93.34
+5V on Top Layer: 36.96,93.34 38.86,93.34 38.86,91.44 36.96,91.44
+5V on Top Layer: 21.21,94.11 22.61,94.11 22.61,92.71 21.21,92.71
+5V on Top Layer: 6.6,70.61 21.21,70.61 21.21,67.44 6.6,67.44
+5V on Top Layer: 18.67,16.94 21.21,16.94 21.21,14.6 18.67,14.6
+5V on Top Layer: 18.67,36.96 21.21,36.96 21.21,35.18 18.67,35.18
+5V on Bottom Layer: 78.1,31.62 84.71,31.62 84.71,28.89 78.1,28.89
+5V on Bottom Layer: 81.28,18.29 82.8,18.29 82.8,16.64 81.28,16.64
+5V on Bottom Layer: 18.67,94.11 21.21,94.11 21.21,25.15 18.67,25.15
+5V on Bottom Layer: 82.42,47.12 84.71,47.12 84.71,16.76 82.42,16.76
+5V on Bottom Layer: 18.67,25.15 21.21,25.15 21.21,16.64 18.67,16.64
+5V on Bottom Layer: 18.67,16.64 82.79,16.64 82.79,14.3 18.67,14.3
+5V on Bottom Layer: 82.8,16.76 84.71,16.76 84.71,14.35 82.8,14.35
+5V on Bottom Layer: 21.21,18.67 23.24,18.67 23.24,16.64 21.21,16.64
GND on Top Layer: -1.4,101.85 107.19,101.85 107.19,-3.3 -1.4,-3.3
GND on Bottom Layer: -6.6,107.7 102.62,107.7 102.62,-2.03 -6.6,-2.03
V_PUMP_D on Top Layer: 66.04,19.43 68.82,19.43 68.82,6.81 66.04,6.81
V_PUMP_D on Bottom Layer: 64.88,12.58 68.82,12.58 68.82,6.81 64.88,6.81
V_PUMP_S on Top Layer: 22.99,19.56 34.93,19.56 34.93,6.73 22.99,6.73

Small or netless copper shapes (teardrops, artwork), in the pictures only: 173 on Top Layer, 69 on Bottom Layer

## Text on the board
Top Silkscreen Layer: T1 | GND | 3.3V | T0 | DIO | CLK | +5V | PC10 | PA15 | PA12 | PA11 | RX | TX | PC12 | PC11 | PB3 | PD2 | PC4 | PB11 | PB12 | PB13 | PC9 | PB15 | PC6 | PC7 | PC8 | PA8 | 5V | 12V | PA3 | PA2 | PA5 | PA6 | PA7 | PB0 | PB1 | PB10 | PC13 | PB9 | PA4 | PUMP_S | PB14 | PUMP_D | 104 | 106 | 8MHz | 1M | 20P | PB4 | PB7 | PB6 | PB5 | 板间通讯 | 摄像头R | 摄像头L | 摄像头M
